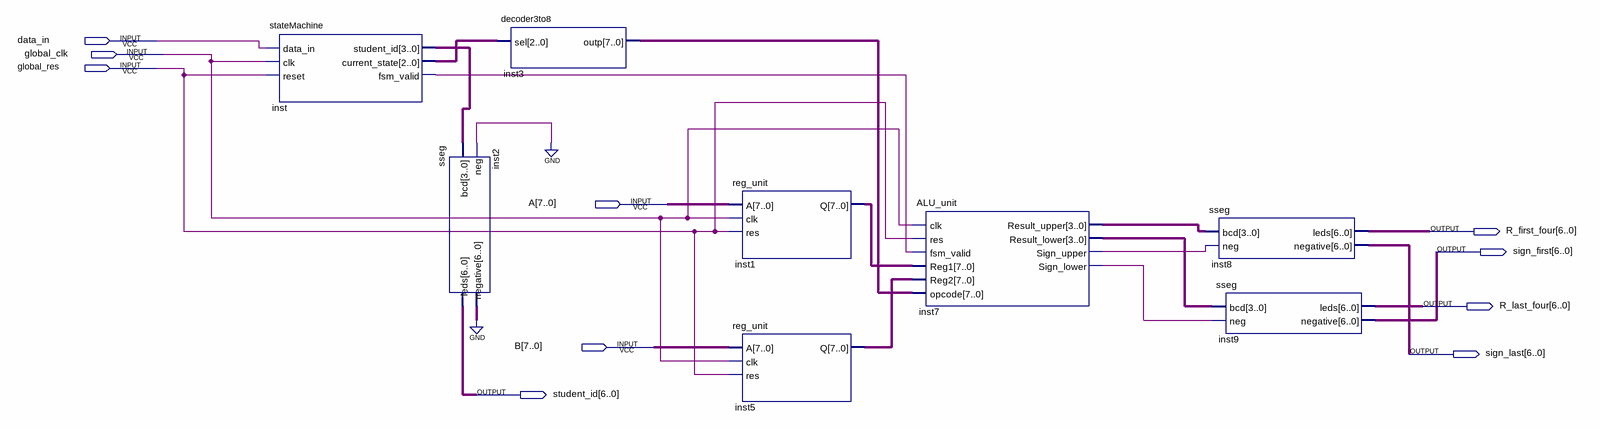
[diagram p0: schematic sheet]
// Quartus schematic mainCPU.bdf as structural Verilog: 8 symbols, 10 pins
module mainCPU (
  input  data_in,
  input  global_clk,
  input  global_res,
  input  [7:0] A,
  input  [7:0] B,
  output [6:0] R_first_four,
  output [6:0] sign_first,
  output [6:0] R_last_four,
  output [6:0] sign_last,
  output [6:0] student_id
);

  wire inst7_sign_lower, inst7_sign_upper, inst_fsm_valid;
  wire [2:0] inst_current_state;
  wire [3:0] inst7_result_lower, inst7_result_upper, inst_student_id;
  wire [6:0] inst2_negative;
  wire [7:0] inst1_q, inst3_outp, inst5_q;

  stateMachine inst (
    .data_in(data_in), .clk(global_clk), .reset(global_res), .student_id(inst_student_id),
    .current_state(inst_current_state), .fsm_valid(inst_fsm_valid));
  sseg inst2 (.bcd(inst_student_id), .neg(1'b0), .leds(student_id), .negative(inst2_negative));
  decoder3to8 inst3 (.sel(inst_current_state), .outp(inst3_outp));
  reg_unit inst1 (.A(A), .clk(global_clk), .res(global_res), .Q(inst1_q));
  reg_unit inst5 (.A(B), .clk(global_clk), .res(global_res), .Q(inst5_q));
  ALU_unit inst7 (
    .clk(global_clk), .res(global_res), .fsm_valid(inst_fsm_valid), .Reg1(inst1_q), .Reg2(inst5_q),
    .opcode(inst3_outp), .Result_upper(inst7_result_upper), .Result_lower(inst7_result_lower),
    .Sign_upper(inst7_sign_upper), .Sign_lower(inst7_sign_lower));
  sseg inst8 (.bcd(inst7_result_upper), .neg(inst7_sign_upper), .leds(R_first_four), .negative(sign_last));
  sseg inst9 (.bcd(inst7_result_lower), .neg(inst7_sign_lower), .leds(R_last_four), .negative(sign_first));
  // also tied to GND on the sheet: {inst2_negative[0], inst2_negative[1], inst2_negative[2], inst2_negative[3], inst2_negative[4], inst2_negative[5], inst2_negative[6]}
endmodule
